# EasyEDA schematic EasyEDA.json

## Sheets
1 Main: TITLE: Box LCD Controller - Main; REV: 1.0; Date: 2022-10-11; Sheet: 1/1; Drawn By: Joseph Telaak; Company: autogolfc.art
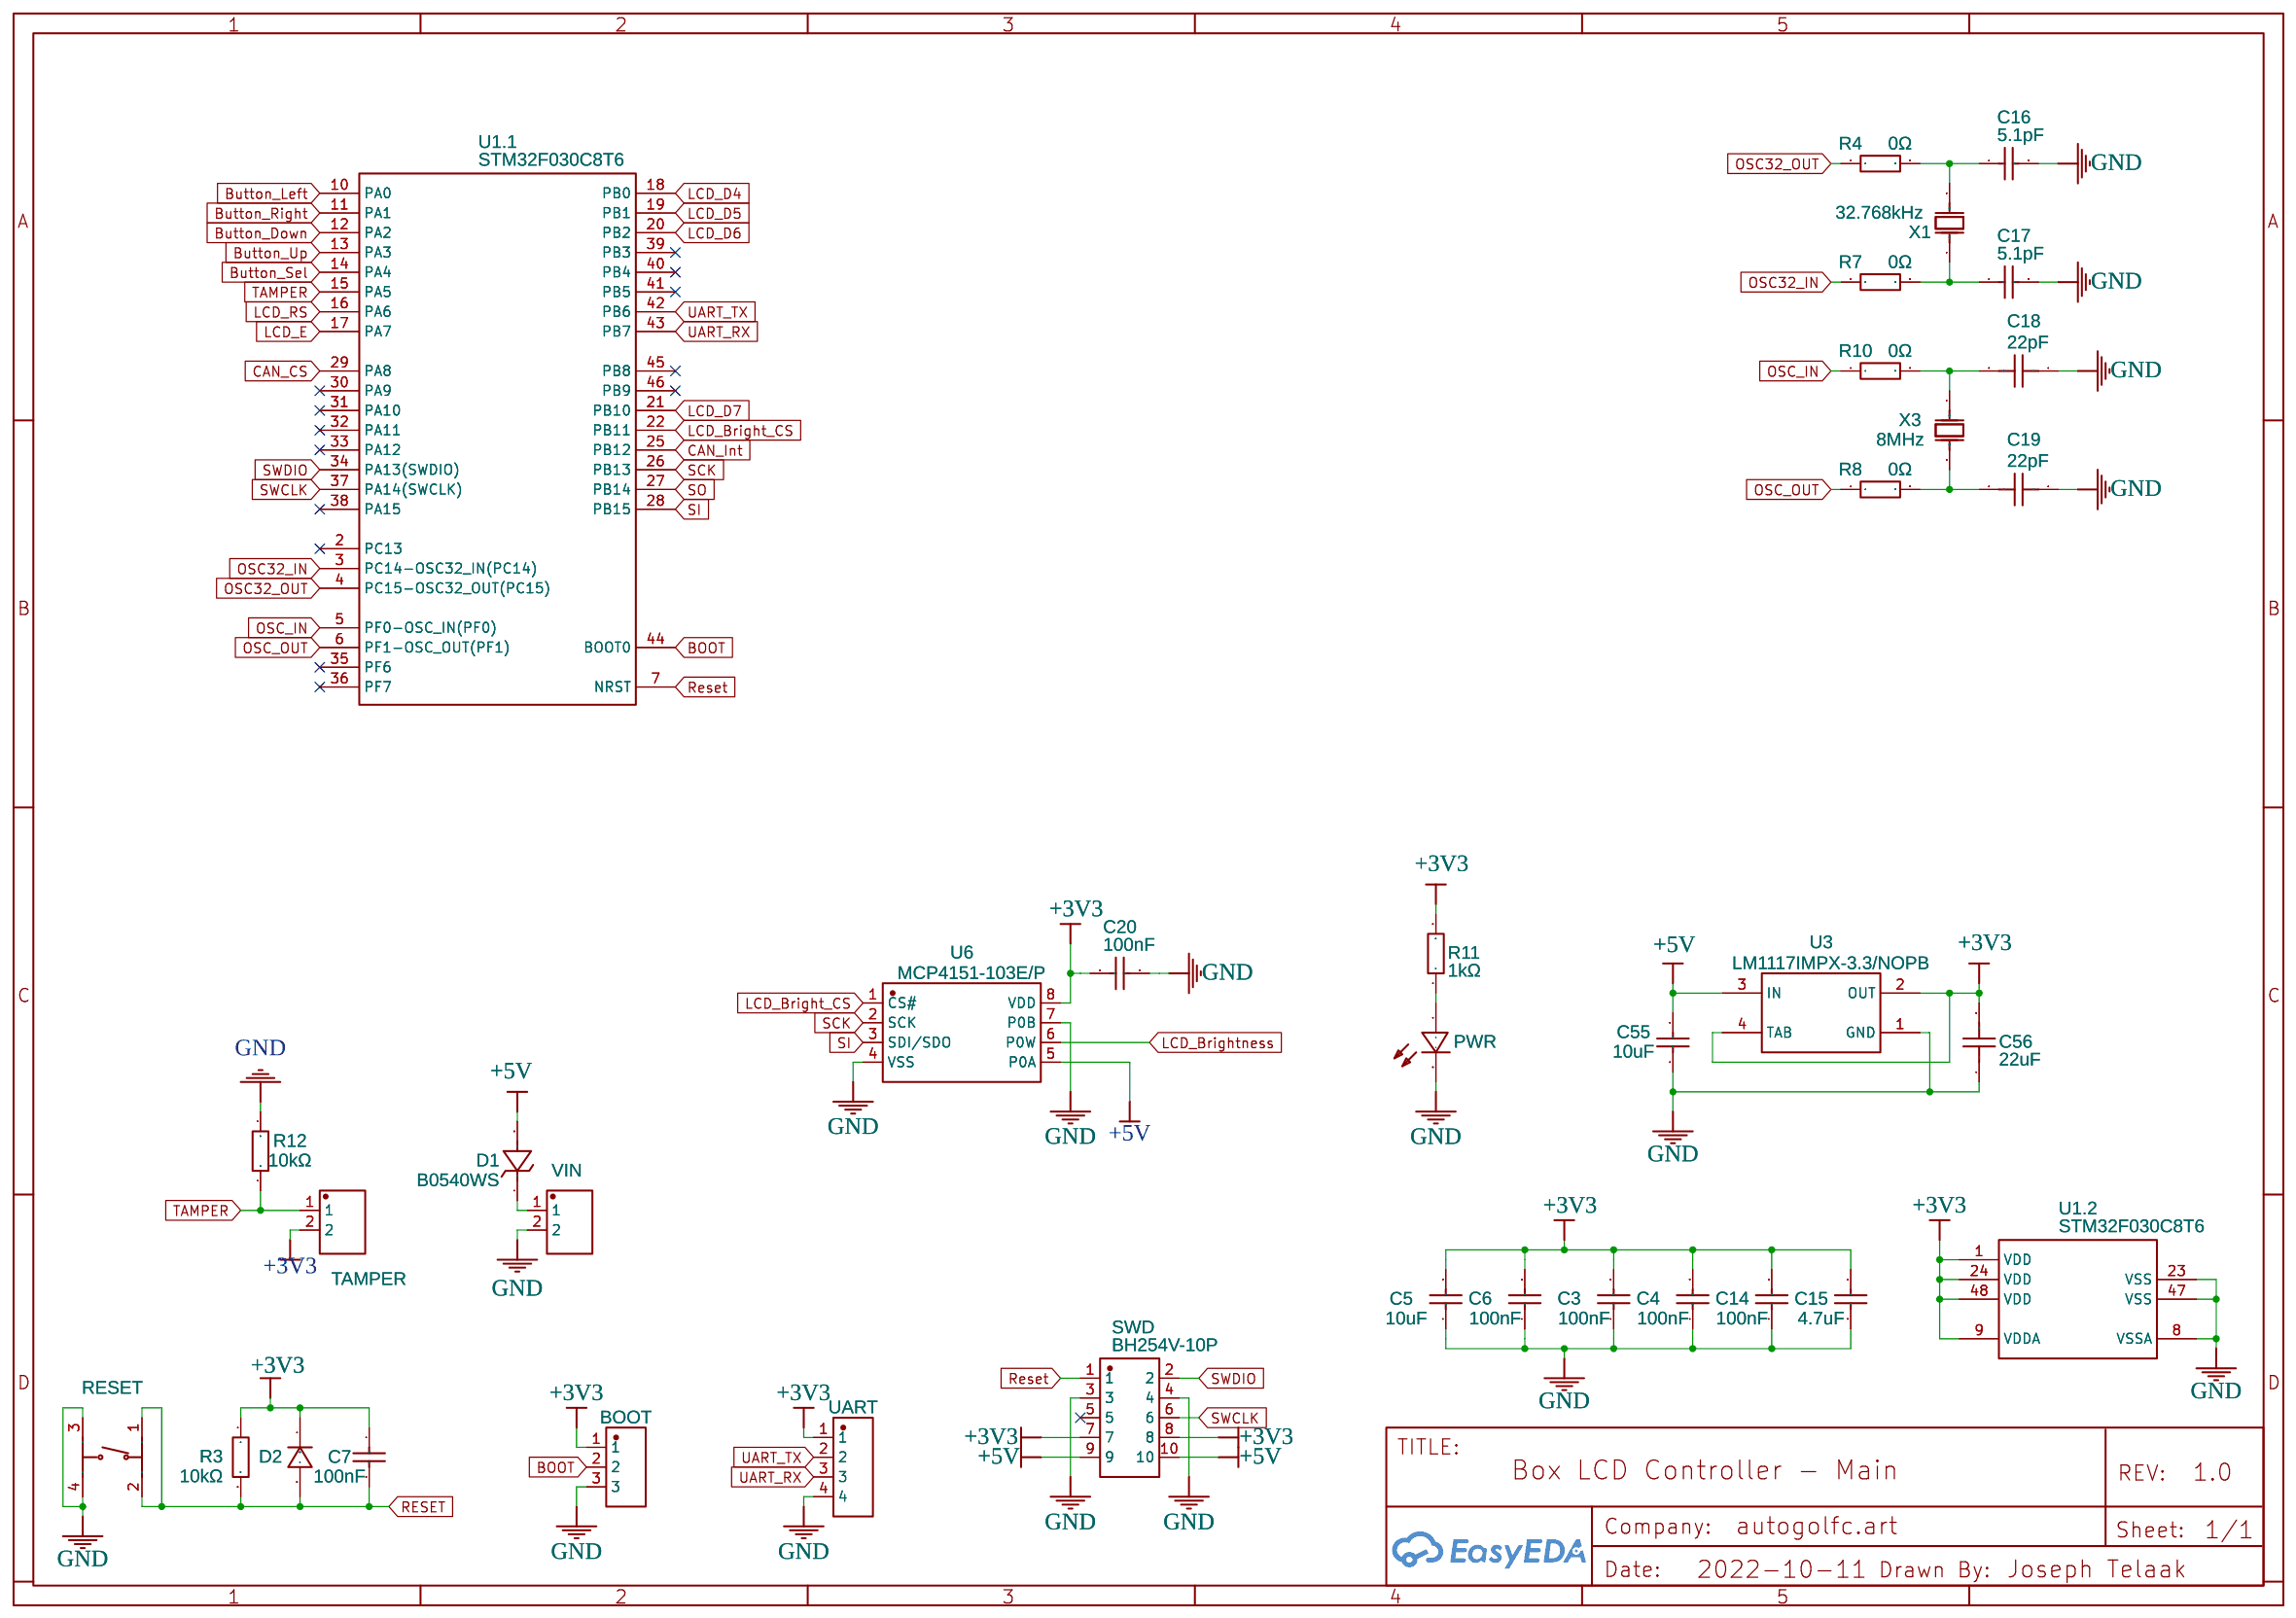
[diagram p0: Main]
2 CAN: TITLE: Box LCD Controller - CAN Interface
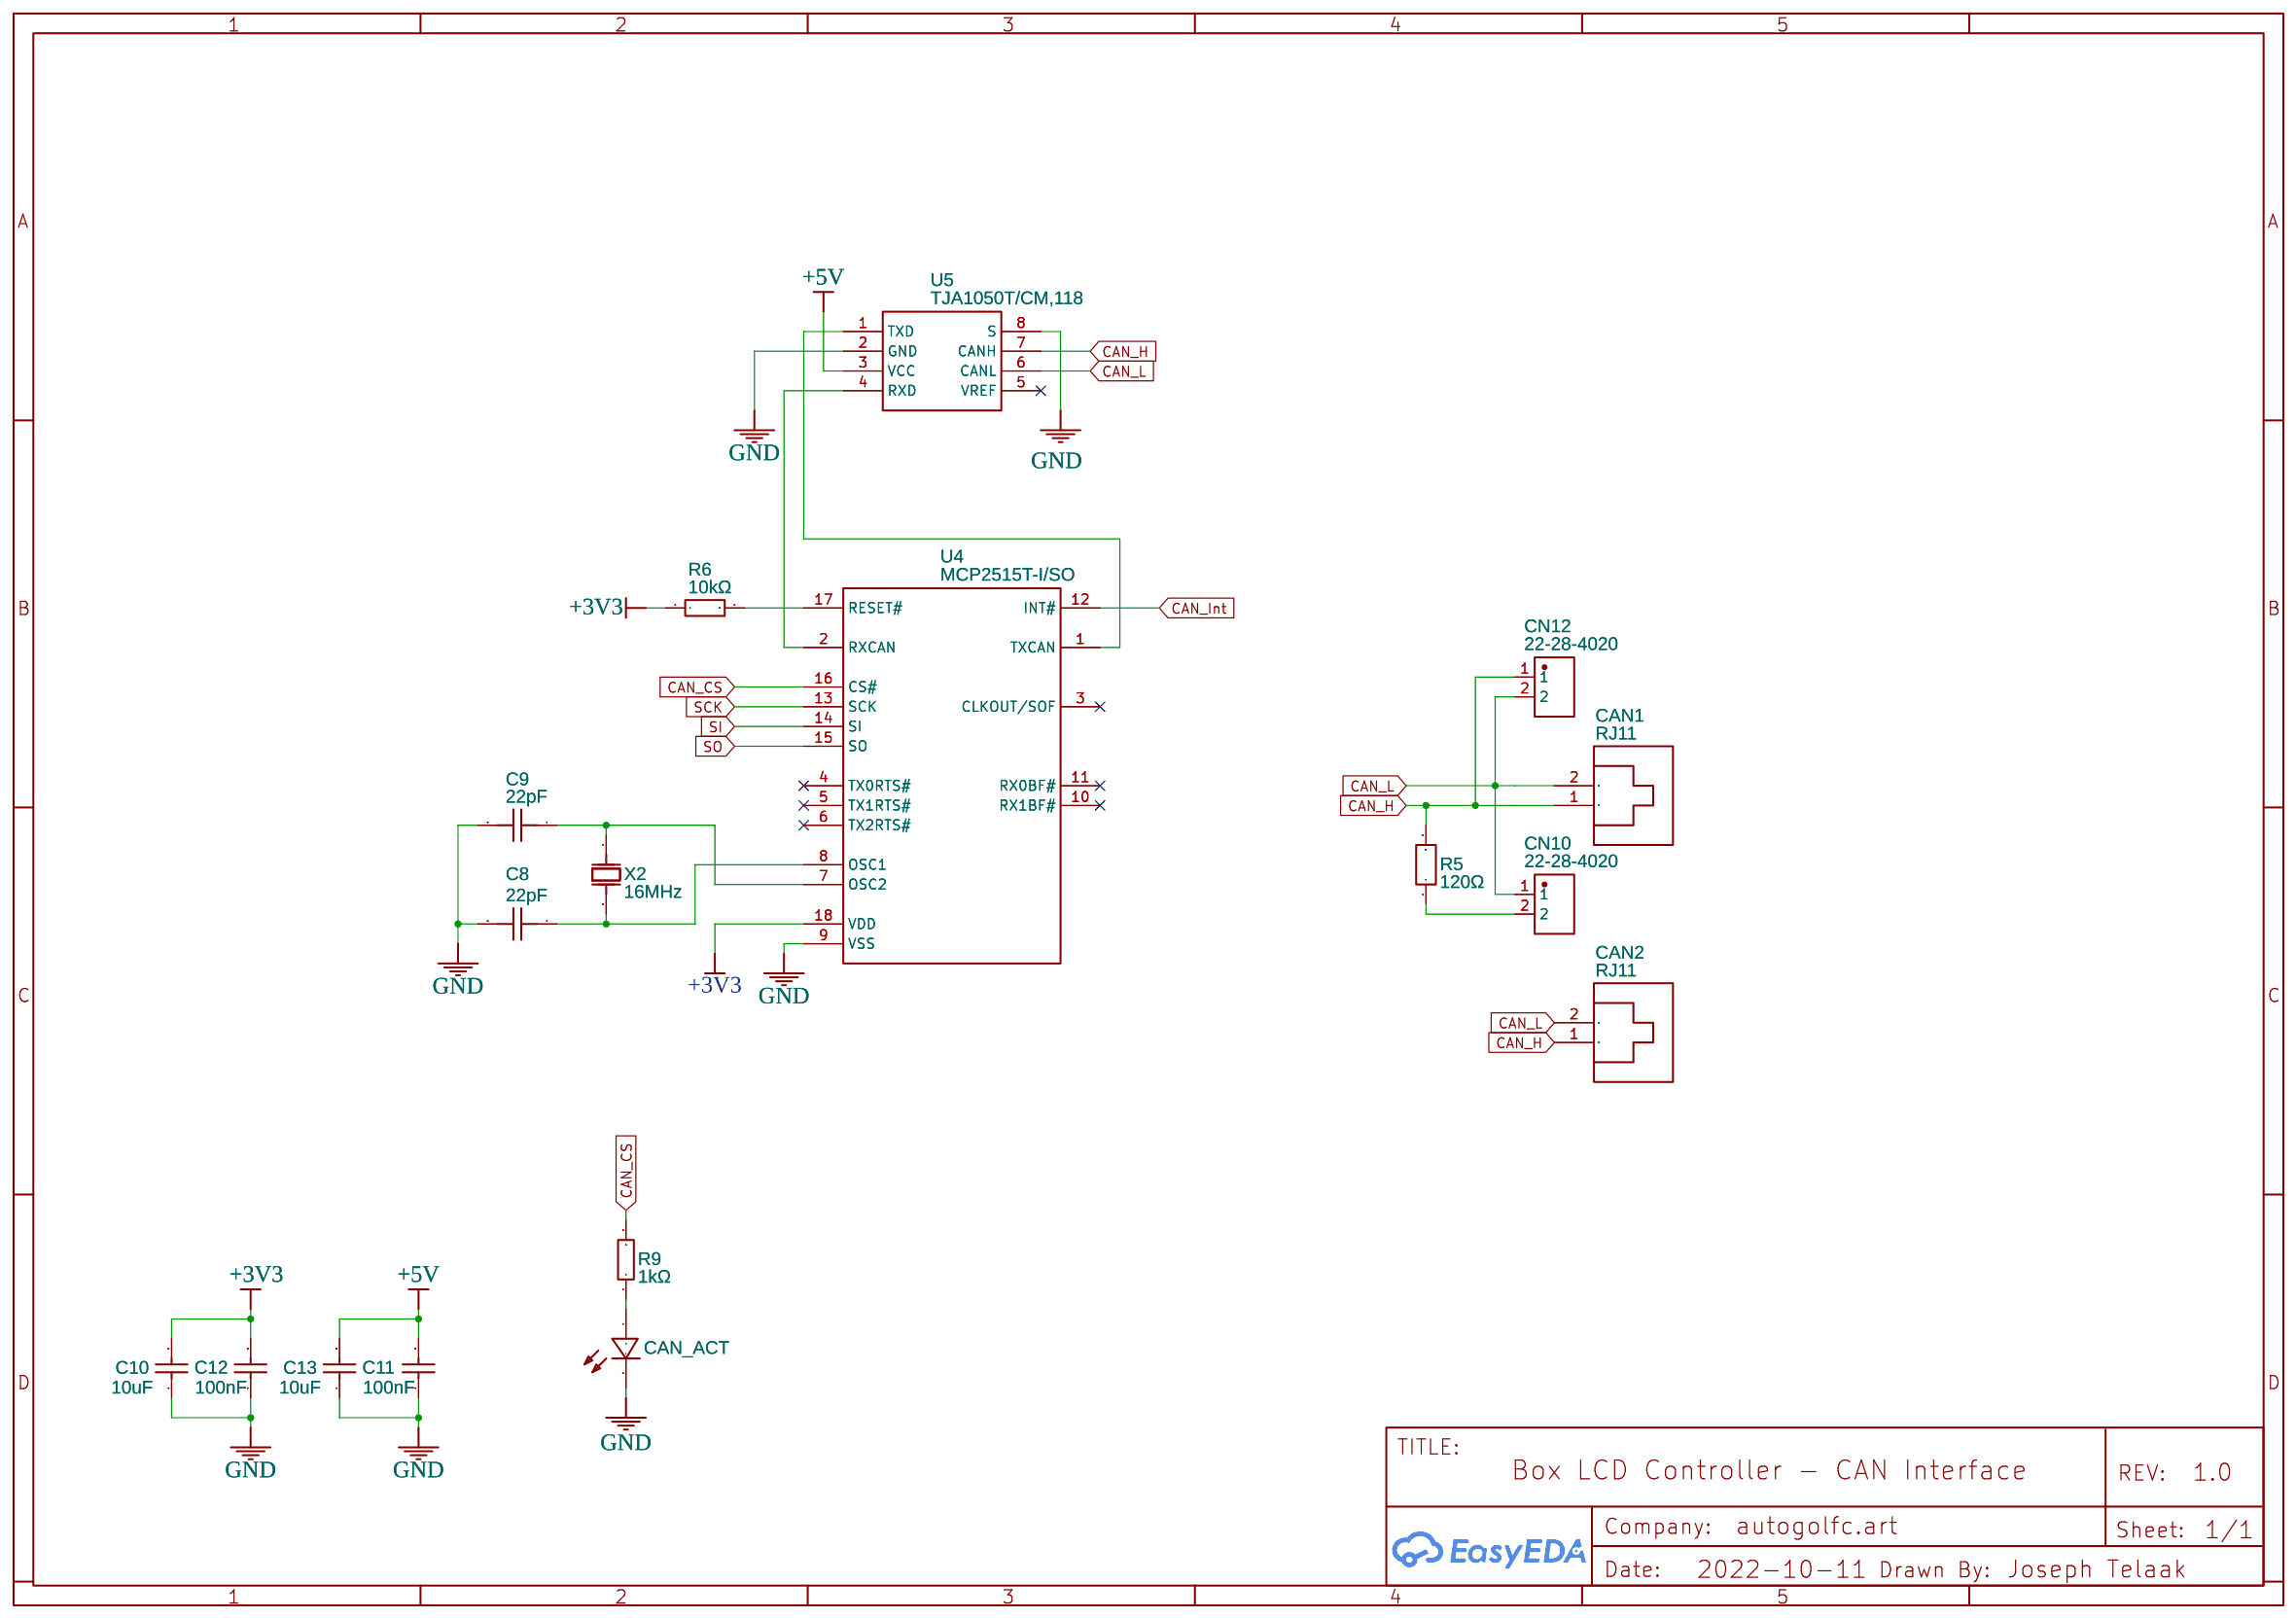
[diagram p1: CAN]
3 LCD: TITLE: Box LCD Controller - LCD Interface
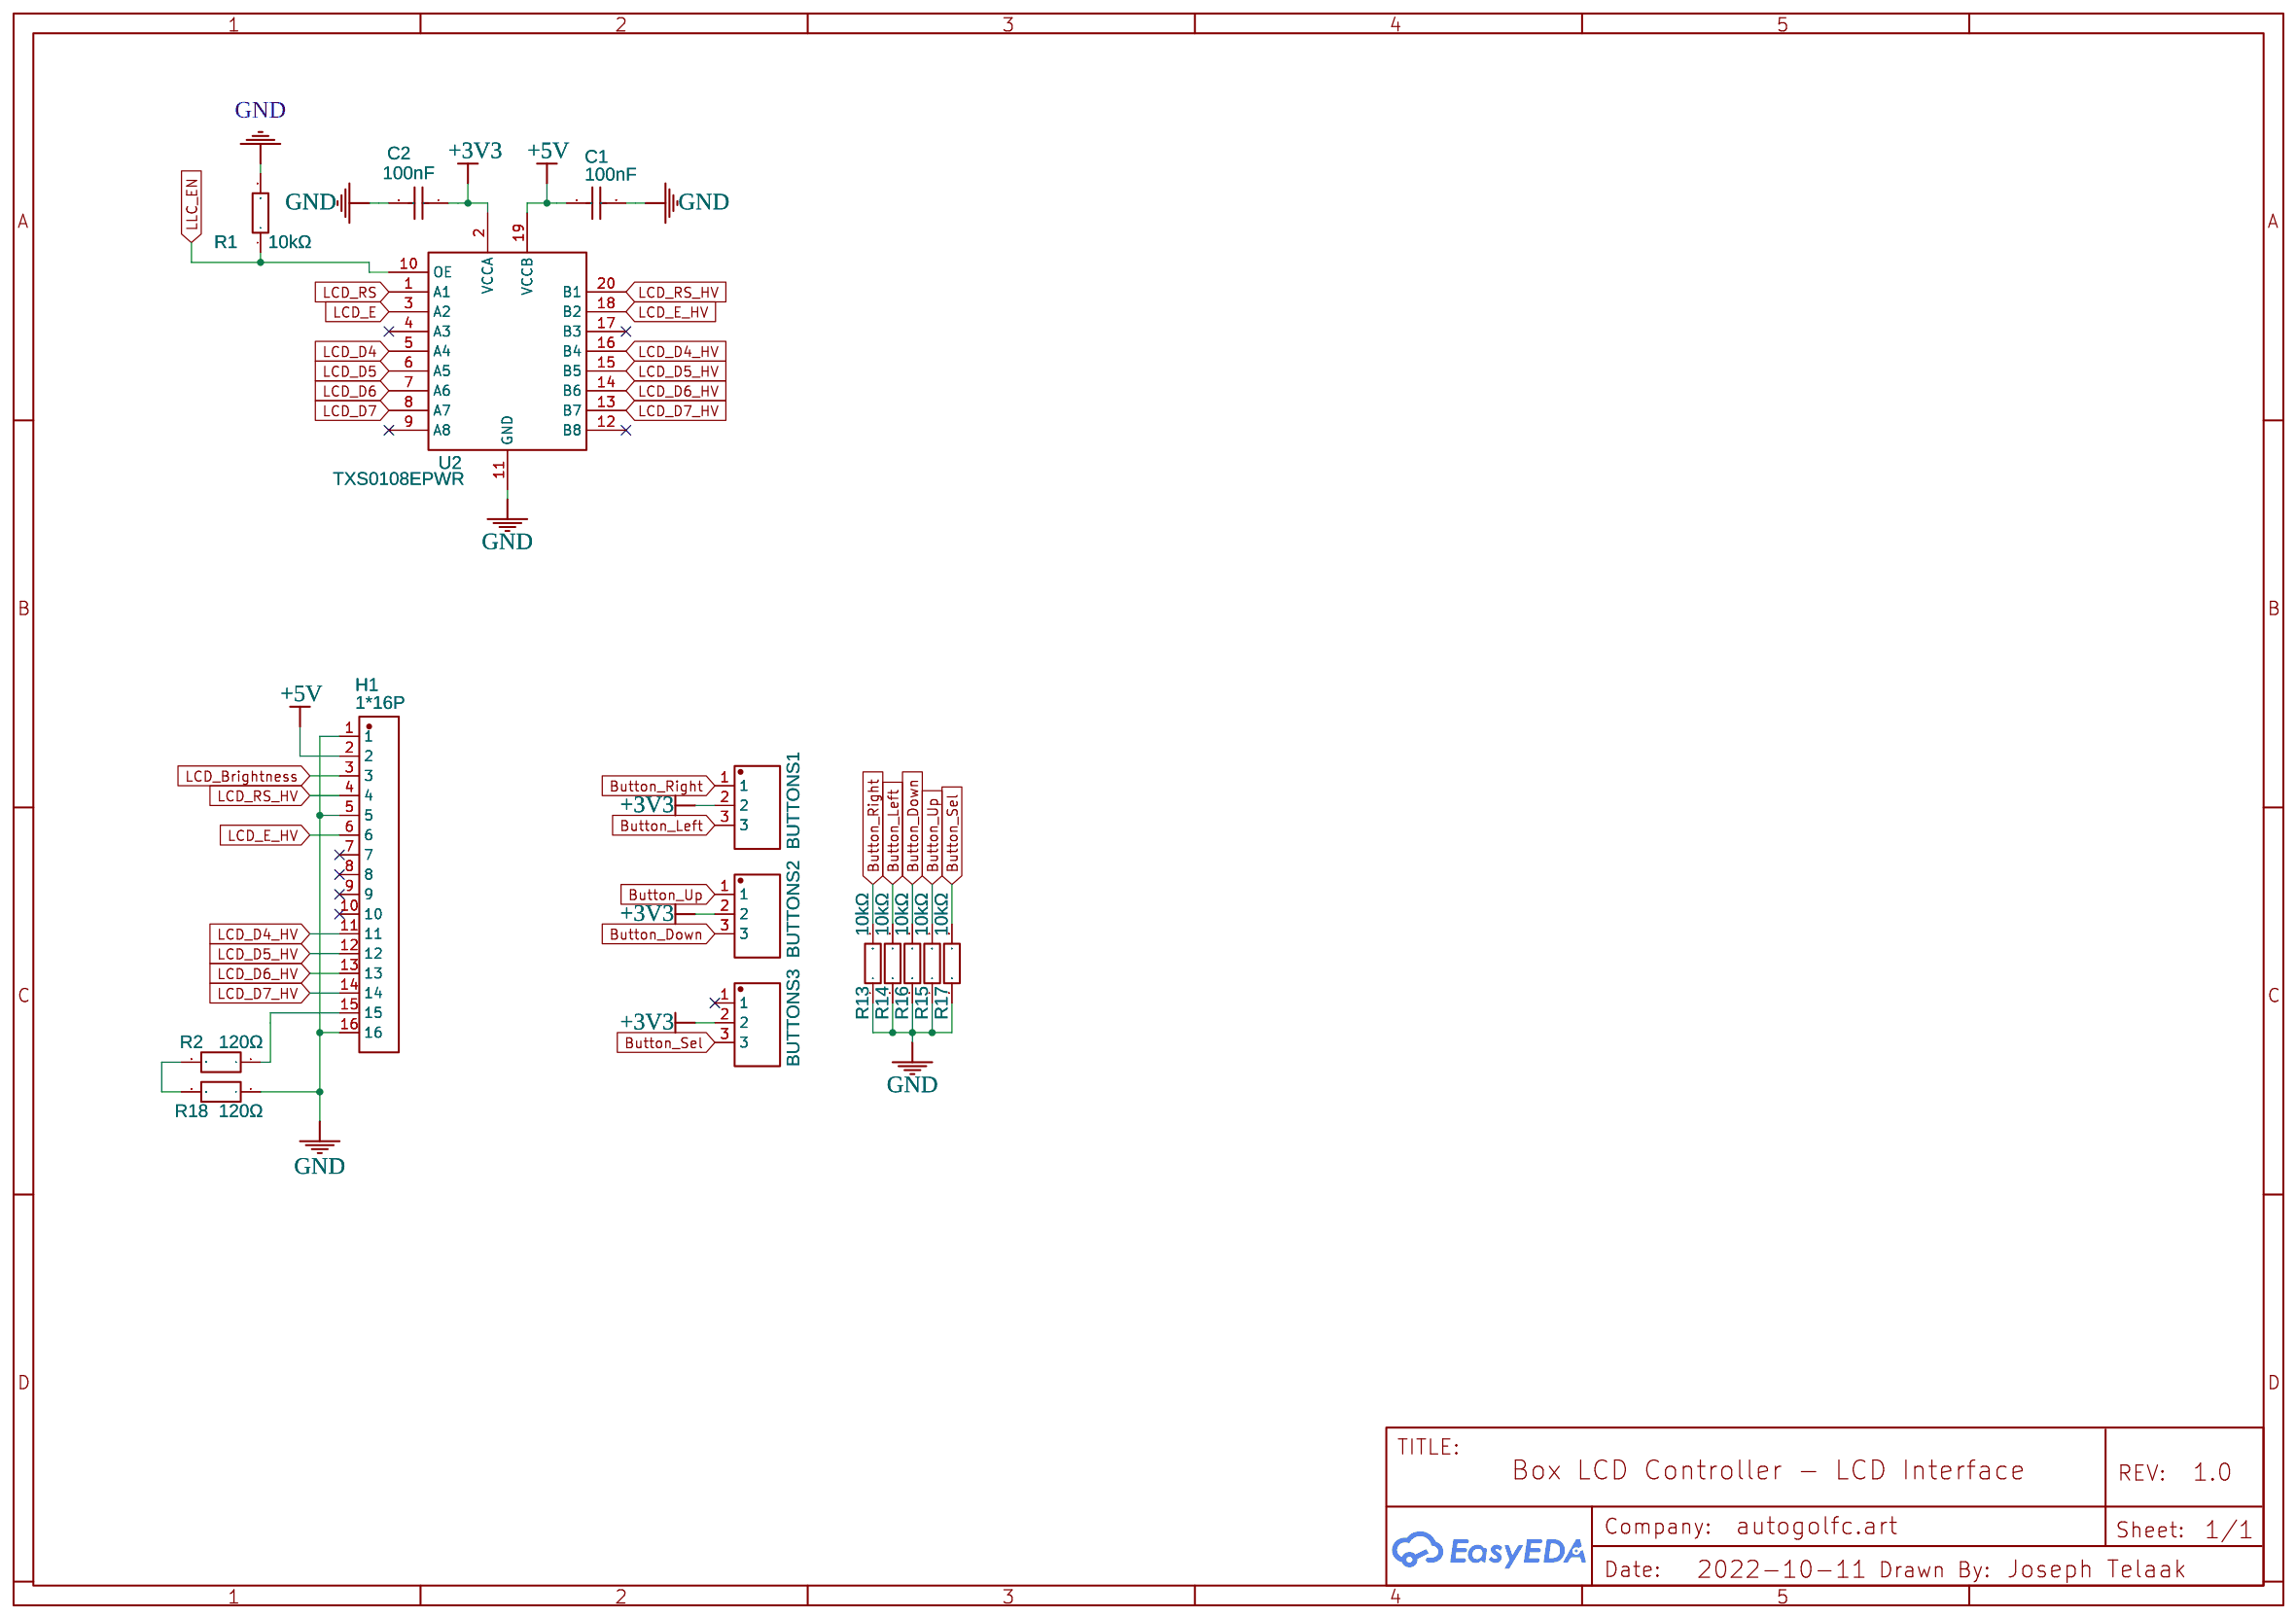
[diagram p2: LCD]

## Parts
sheet CAN
C8  22pF  [C0603]
C9  22pF  [C0603]
C10  10uF  [C0603]
C11  100nF  [C0603]
C12  100nF  [C0603]
C13  10uF  [C0603]
CAN1  RJ11  [RJ11-TH_55A-1X1-6P2C-E-13H]
CAN2  RJ11  [RJ11-TH_55A-1X1-6P2C-E-13H]
CAN_ACT  FC-1608GHK-570A08  [LED0603-R-RD]
CN10  22-28-4020  [HDR-TH_2P-P2.54-V-M-1]
CN12  22-28-4020  [HDR-TH_2P-P2.54-V-M-1]
R5  120Ω  [R0603]
R6  10kΩ  [R0603]
R9  1kΩ  [R0603]
U4  MCP2515T-I/SO  [SOIC-18_L11.6-W7.5-P1.27-LS10.3-BL]
U5  TJA1050T/CM,118  [SOIC-8_L5.0-W4.0-P1.27-LS6.0-BL]
X2  16MHz  [OSC-TH_L10.0-W4.5-P5.00]
sheet LCD
BUTTONS1  WJ15EDGRC-3.81-3P  [CONN-TH_3P-P3.81_WJ15EDGRC-3.81-3P]
BUTTONS2  WJ15EDGRC-3.81-3P  [CONN-TH_3P-P3.81_WJ15EDGRC-3.81-3P]
BUTTONS3  WJ15EDGRC-3.81-3P  [CONN-TH_3P-P3.81_WJ15EDGRC-3.81-3P]
C1  100nF  [C0603]
C2  100nF  [C0603]
H1  1*16P  [HDR-TH_16P-P2.54-V-M]
R1  10kΩ  [R0603]
R2  120Ω  [R0603]
R13  10kΩ  [R0603]
R14  10kΩ  [R0603]
R15  10kΩ  [R0603]
R16  10kΩ  [R0603]
R17  10kΩ  [R0603]
R18  120Ω  [R0603]
U2  TXS0108EPWR  [TSSOP-20_L6.5-W4.4-P0.65-LS6.4-BL]
sheet Main
BOOT  PZ254V-11-03P_C2937625  [HDR-TH_3P-P2.54-V-M]
C3  100nF  [C0603]
C4  100nF  [C0603]
C5  10uF  [C0603]
C6  100nF  [C0603]
C7  100nF  [C0603]
C14  100nF  [C0603]
C15  4.7uF  [C0603]
C16  5.1pF  [C0603]
C17  5.1pF  [C0603]
C18  22pF  [C0603]
C19  22pF  [C0603]
C20  100nF  [C0603]
C55  10uF  [C0603]
C56  22uF  [C0603]
D1  B0540WS  [SOD-323_L1.7-W1.3-LS2.6-RD-1]
D2  1N914BWS  [SOD-323_L1.8-W1.3-LS2.5-RD]
PWR  FC-1608GHK-570A08  [LED0603-R-RD]
R3  10kΩ  [R0603]
R4  0Ω  [R0603]
R7  0Ω  [R0603]
R8  0Ω  [R0603]
R10  0Ω  [R0603]
R11  1kΩ  [R0603]
R12  10kΩ  [R0603]
RESET  TS-1187A-B-A-B  [SW-SMD_4P-L5.1-W5.1-P3.70-LS6.5-TL-2]
SWD  BH254V-10P  [IDC-TH_10P-P2.54-V-R2-C5-S2.54]
TAMPER  WJ15EDGRC-3.81-2P  [CONN-TH_2P-P3.81_WJ15EDGRC-3.81-2P]
U1  STM32F030C8T6  [LQFP-48_L7.0-W7.0-P0.50-LS9.0-BL]  (sections 1,2)
U3  LM1117IMPX-3.3/NOPB  [SOT-223_L6.5-W3.5-P2.30-LS7.0-BR]
U6  MCP4151-103E/P  [PDIP-8_L9.3-W6.4-P2.54-LS7.6-BL]
UART  PZ254V-11-04P_C2691448  [HDR-TH_4P-P2.54-V-M]
VIN  WJ15EDGRC-3.81-2P  [CONN-TH_2P-P3.81_WJ15EDGRC-3.81-2P]
X1  32.768kHz  [OSC-SMD_L3.2-W1.5]
X3  8MHz  [OSC-TH_L10.0-W4.5-P5.00]

## Library data of the parts
C8 C9 C18 C19 = CGA3E2C0G1H220JT0Y0N: Supplier: LCSC; Supplier Part: C338053; Manufacturer: TDK; Contributor: LCSC; JLCPCB Part Class: Extended Part
C5 C10 C13 C55 = JMK107BJ106MA-T: Supplier: LCSC; Manufacturer: TAIYO YUDEN; Supplier Part: C87152; JLCPCB Part Class: Extended Part
C1-C4 C6 C7 C11 C12 C14 C20 = FN18X104K500PBG: Supplier: LCSC; Supplier Part: C235731; Manufacturer: Prosperity Dielectrics; Contributor: LCSC; JLCPCB Part Class: Extended Part
CAN1 CAN2 = PCB-6P2C-90_C189745: Supplier: LCSC; Supplier Part: C189745; Manufacturer: Shenzhen Cankemeng; Contributor: LCSC; JLCPCB Part Class: Extended Part
CAN_ACT PWR = FC-1608GHK-570A08: Supplier: LCSC; Supplier Part: C193901; Manufacturer: Foshan NationStar Optoelectronics; Contributor: LCSC; JLCPCB Part Class: Extended Part
CN10 CN12 = 22-28-4020: Supplier: LCSC; Supplier Part: C234182; Manufacturer: MOLEX; Contributor: LCSC; JLCPCB Part Class: Extended Part
R2 R5 R18 = ERJPA3J121V: Supplier: LCSC; Supplier Part: C445808; Manufacturer: PANASONIC; Contributor: LCSC; JLCPCB Part Class: Extended Part
R3 R6 = RMS06FT1002: Supplier: LCSC; Supplier Part: C209013; Manufacturer: TA-I Tech; Resistance (Ohms): 10K; Contributor: LCSC; JLCPCB Part Class: Extended Part
R9 R11 = TR0603B1KP0525: Supplier: LCSC; Supplier Part: C188364; Manufacturer: Ever Ohms Tech; Resistance (Ohms): 1K; Contributor: LCSC; JLCPCB Part Class: Extended Part
U4 = MCP2515T-I/SO: Supplier: LCSC; Manufacturer: MICROCHIP; Contributor: LCSC; Supplier Part: C153782; JLCPCB Part Class: Extended Part
U5 = TJA1050T/CM,118: Supplier: LCSC; Manufacturer: NXP; Supplier Part: C6952; JLCPCB Part Class: Basic Part
X2 = X49SD16MSD2SC: Supplier: LCSC; Manufacturer: YXC; Supplier Part: C16212; JLCPCB Part Class: Extended Part
BUTTONS1-BUTTONS3 = WJ15EDGRC-3.81-3P: Supplier: LCSC; Manufacturer: ReliaPro; Supplier Part: C8406; JLCPCB Part Class: Extended Part
H1 = X6511WV-16H-C30D60: Supplier: LCSC; Supplier Part: C725948; Manufacturer: XKB Connectivity; Contributor: LCSC; JLCPCB Part Class: Extended Part
R1 R12-R17 = ERJ3GEYJ103V: Supplier: LCSC; Manufacturer: PANASONIC; Resistance (Ohms): 10K; Contributor: LCSC; Supplier Part: C169849; JLCPCB Part Class: Extended Part
U2 = TXS0108EPWR: Supplier: LCSC; Manufacturer: TI; Supplier Part: C17206; JLCPCB Part Class: Extended Part
BOOT = PZ254V-11-03P_C2937625: Supplier: LCSC; Supplier Part: C2937625; Manufacturer: XFCN(台湾兴飞); Manufacturer Part: PZ254V-11-03P; Contributor: LCSC; JLCPCB Part Class: Extended Part
C15 = EMK107ABJ475KA-T: Supplier: LCSC; Manufacturer: TAIYO YUDEN; Supplier Part: C92758; JLCPCB Part Class: Extended Part
C16 C17 = 0603CG5R1C500NT: Supplier: LCSC; Manufacturer: FH; Supplier Part: C61816; JLCPCB Part Class: Extended Part
C56 = GRM188R61A226ME15D: Supplier: LCSC; Manufacturer: MuRata; Supplier Part: C84419; JLCPCB Part Class: Extended Part
D1 = B0540WS_C2961214: Supplier: LCSC; Supplier Part: C2961214; Manufacturer: CJ（江苏长电/长晶）; Contributor: LCSC; JLCPCB Part Class: Extended Part
D2 = 1N914BWS: Supplier: LCSC; Supplier Part: C258181; Manufacturer: ON Semicon; Contributor: LCSC; JLCPCB Part Class: Extended Part
R4 R7 R8 R10 = ERJ-3GEY0R00V: Supplier: LCSC; Manufacturer: PANASONIC; Supplier Part: C122704; Resistance (Ohms): 0; JLCPCB Part Class: Extended Part
RESET = TS-1187A-B-A-B: Supplier: LCSC; Supplier Part: C318884; Manufacturer: XKB Enterprise; Contributor: LCSC; JLCPCB Part Class: Basic Part
SWD = BH254V-10P: Supplier: LCSC; Supplier Part: C492442; Manufacturer: XFCN; Contributor: LCSC; JLCPCB Part Class: Extended Part
TAMPER VIN = WJ15EDGRC-3.81-2P: Supplier: LCSC; Manufacturer: ReliaPro; Supplier Part: C8387; JLCPCB Part Class: Extended Part
U1 = STM32F030C8T6: tags: STM32; Supplier Part: C23922; Supplier: LCSC; Manufacturer: ST; subpart_no: 1; image: http://image.lceda.cn/szlcsc/C23922.jpg; JLCPCB Part Class: Basic Part
U3 = LM1117IMPX-3.3/NOPB: Supplier: LCSC; Manufacturer: TI; Supplier Part: C23984; JLCPCB Part Class: Extended Part
U6 = MCP4151-103E/P: Supplier: LCSC; Supplier Part: C640369; Manufacturer: MICROCHIP(美国微芯); link: https://atta.szlcsc.comnull; Contributor: lcsc
UART = PZ254V-11-04P_C2691448: Supplier: LCSC; Supplier Part: C2691448; Manufacturer: XFCN(台湾兴飞); Manufacturer Part: PZ254V-11-04P; Contributor: LCSC; JLCPCB Part Class: Extended Part
X1 = NX3215SA-32.768KHZ(STD-MUA-8): Supplier: LCSC; Supplier Part: C156245; Manufacturer: Nihon Dempa Kogyo; Contributor: LCSC; JLCPCB Part Class: Extended Part
X3 = X49SD8MSD2SC: Supplier: LCSC; Manufacturer: YXC; Supplier Part: C21263; JLCPCB Part Class: Extended Part

## Nets
+3V3: BOOT.1 BUTTONS1.2 BUTTONS2.2 BUTTONS3.2 C2.1 C3.2 C4.2 C5.2 C6.2 C7.1 C10.2 C12.2 C14.2 C15.1 C20.2 C56.2 D2.1(C) R3.1 R6.1 R11.2 SWD.7 SWD.8 TAMPER.2 U1.1(VDD) U1.9(VDDA) U1.24(VDD) U1.48(VDD) U2.2(VCCA) U3.2(OUT) U3.4(TAB) U4.18(VDD) U6.8(VDD) UART.1
+5V: C1.1 C11.2 C13.2 C55.1 D1.2(A) H1.2 SWD.9 SWD.10 U2.19(VCCB) U3.3(IN) U5.3(VCC) U6.5(P0A)
GND: BOOT.3 C1.2 C2.2 C3.1 C4.1 C5.1 C6.1 C8.2 C9.2 C10.1 C11.1 C12.1 C13.1 C14.1 C15.2 C16.2 C17.2 C18.1 C19.1 C20.1 C55.2 C56.1 CAN_ACT.2(-) H1.1 H1.5 H1.16 PWR.2(-) R1.2 R12.2 R13.1 R14.1 R15.1 R16.1 R17.1 R18.1 RESET.3(C) RESET.4(D) SWD.3 SWD.4 U1.8(VSSA) U1.23(VSS) U1.47(VSS) U2.11(GND) U3.1(GND) U4.9(VSS) U5.2(GND) U5.8(S) U6.4(VSS) U6.7(P0B) UART.4 VIN.2
BOOT: BOOT.2 U1.44(BOOT0)
Button_Down: BUTTONS2.3 R16.2 U1.12(PA2)
Button_Left: BUTTONS1.3 R14.2 U1.10(PA0)
Button_Right: BUTTONS1.1 R13.2 U1.11(PA1)
Button_Sel: BUTTONS3.3 R17.2 U1.14(PA4)
Button_Up: BUTTONS2.1 R15.2 U1.13(PA3)
CAN_CS: R9.2 U1.29(PA8) U4.16(CS#)
CAN_H: CAN1.1 CAN2.1 CN12.1 R5.2 U5.7(CANH)
CAN_Int: U1.25(PB12) U4.12(INT#)
CAN_L: CAN1.2 CAN2.2 CN10.1 CN12.2 U5.6(CANL)
LCD_Bright_CS: U1.22(PB11) U6.1(CS#)
LCD_Brightness: H1.3 U6.6(P0W)
LCD_D4: U1.18(PB0) U2.5(A4)
LCD_D4_HV: H1.11 U2.16(B4)
LCD_D5: U1.19(PB1) U2.6(A5)
LCD_D5_HV: H1.12 U2.15(B5)
LCD_D6: U1.20(PB2) U2.7(A6)
LCD_D6_HV: H1.13 U2.14(B6)
LCD_D7: U1.21(PB10) U2.8(A7)
LCD_D7_HV: H1.14 U2.13(B7)
LCD_E: U1.17(PA7) U2.3(A2)
LCD_E_HV: H1.6 U2.18(B2)
LCD_RS: U1.16(PA6) U2.1(A1)
LCD_RS_HV: H1.4 U2.20(B1)
LLC_EN: R1.1 U2.10(OE)
OSC32_IN: R7.1 U1.3(PC14-OSC32_IN(PC14))
OSC32_OUT: R4.1 U1.4(PC15-OSC32_OUT(PC15))
OSC_IN: R10.1 U1.5(PF0-OSC_IN(PF0))
OSC_OUT: R8.1 U1.6(PF1-OSC_OUT(PF1))
Reset: SWD.1 U1.7(NRST)
RESET: C7.2 D2.2(A) R3.2 RESET.1(A) RESET.2(B)
SCK: U1.26(PB13) U4.13(SCK) U6.2(SCK)
SI: U1.28(PB15) U4.14(SI) U6.3(SDI/SDO)
SO: U1.27(PB14) U4.15(SO)
SWCLK: SWD.6 U1.37(PA14(SWCLK))
SWDIO: SWD.2 U1.34(PA13(SWDIO))
TAMPER: R12.1 TAMPER.1 U1.15(PA5)
UART_RX: U1.43(PB7) UART.3
UART_TX: U1.42(PB6) UART.2
Net-(C8-1): C8.1 U4.8(OSC1) X2.2(OSC2)
Net-(C9-1): C9.1 U4.7(OSC2) X2.1(OSC1)
Net-(C16-1): C16.1 R4.2 X1.2(OSC2)
Net-(C17-1): C17.1 R7.2 X1.1(OSC1)
Net-(C18-2): C18.2 R10.2 X3.1(OSC1)
Net-(C19-2): C19.2 R8.2 X3.2(OSC2)
Net-(CAN_ACT-1): CAN_ACT.1(+) R9.1
Net-(CN10-2): CN10.2 R5.1
Net-(D1-1): D1.1(K) VIN.1
Net-(H1-15): H1.15 R2.1
Net-(PWR-1): PWR.1(+) R11.1
Net-(R2-2): R2.2 R18.2
Net-(R6-2): R6.2 U4.17(RESET#)
Net-(U4-1): U4.1(TXCAN) U5.1(TXD)
Net-(U4-2): U4.2(RXCAN) U5.4(RXD)

Not connected (* = marked no-connect by the designer): BUTTONS3 1*; H1 7* 8* 9* 10*; SWD 5*; U1 2(PC13)* 30(PA9)* 31(PA10)* 32(PA11)* 33(PA12)* 35(PF6)* 36(PF7)* 38(PA15)* 39(PB3)* 40(PB4)* 41(PB5)* 45(PB8)* 46(PB9)*; U2 4(A3)* 9(A8)* 12(B8)* 17(B3)*; U4 3(CLKOUT/SOF)* 4(TX0RTS#)* 5(TX1RTS#)* 6(TX2RTS#)* 10(RX1BF#)* 11(RX0BF#)*; U5 5(VREF)*
